# EAGLE design bbbshield (EAGLE 7.5.0)
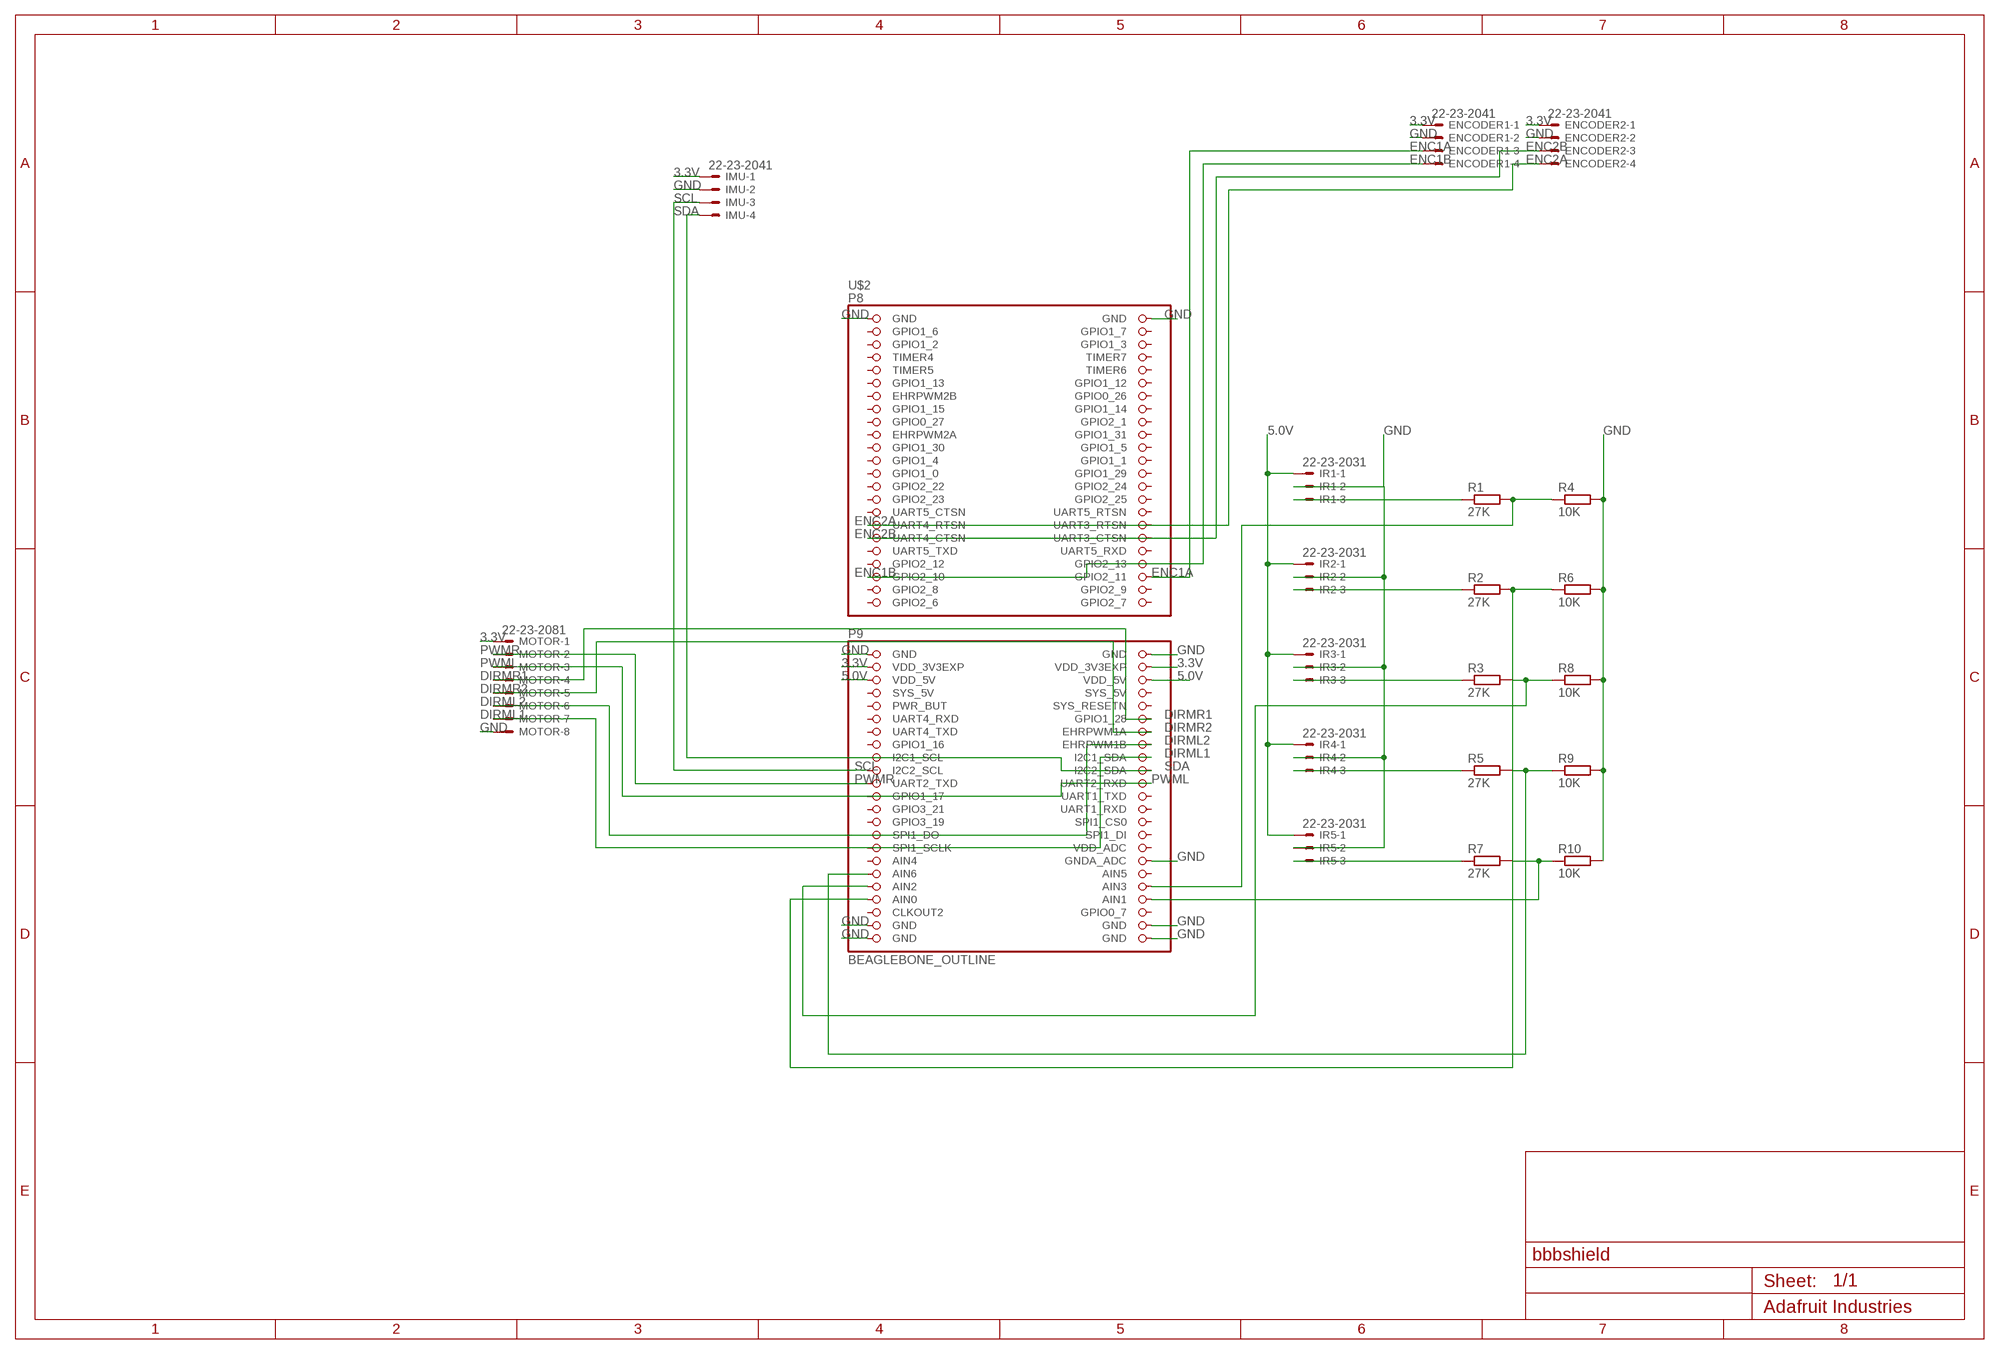
[diagram p0: schematic, sheet 1]

## Parts
ENCODER1  22-23-2041  [22-23-2041]
ENCODER2  22-23-2041  [22-23-2041]
IMU  22-23-2041  [22-23-2041]
IR1  22-23-2031  [22-23-2031]
IR2  22-23-2031  [22-23-2031]
IR3  22-23-2031  [22-23-2031]
IR4  22-23-2031  [22-23-2031]
IR5  22-23-2031  [22-23-2031]
MOTOR  22-23-2081  [22-23-2081]
R1  27K  R-EU_R0603  [R0603]
R2  27K  R-EU_R0603  [R0603]
R3  27K  R-EU_R0603  [R0603]
R4  10K  R-EU_R0603  [R0603]
R5  27K  R-EU_R0603  [R0603]
R6  10K  R-EU_R0603  [R0603]
R7  27K  R-EU_R0603  [R0603]
R8  10K  R-EU_R0603  [R0603]
R9  10K  R-EU_R0603  [R0603]
R10  10K  R-EU_R0603  [R0603]
U$2  BEAGLEBONE_OUTLINE  [BEAGLEBONE_SHIELD]

## Nets
3.3V: ENCODER1.1 ENCODER2.1 IMU.1 MOTOR.1 U$2.49(VDD_3V3EXP) U$2.50(VDD_3V3EXP)
5.0V: IR1.1 IR2.1 IR3.1 IR4.1 IR5.1 U$2.51(VDD_5V) U$2.52(VDD_5V)
DIRML1: MOTOR.7 U$2.64(I2C1_SDA)
DIRML2: MOTOR.6 U$2.62(EHRPWM1B)
DIRMR1: MOTOR.4 U$2.58(GPIO1_28)
DIRMR2: MOTOR.5 U$2.60(EHRPWM1A)
ENC1A: ENCODER1.3 U$2.42(GPIO2_11)
ENC1B: ENCODER1.4 U$2.41(GPIO2_10)
ENC2A: ENCODER2.4 U$2.33(UART4_RTSN)
ENC2B: ENCODER2.3 U$2.35(UART4_CTSN)
GND: ENCODER1.2 ENCODER2.2 IMU.2 IR1.2 IR2.2 IR3.2 IR4.2 IR5.2 MOTOR.8 R4.2 R6.2 R8.2 R9.2 R10.2 U$2.1(GND) U$2.2(GND) U$2.47(GND) U$2.48(GND) U$2.80(GNDA_ADC) U$2.89(GND) U$2.90(GND) U$2.91(GND) U$2.92(GND)
N$12: IR1.3 R1.1
N$18: IR2.3 R2.1
N$19: IR3.3 R3.1
N$21: IR4.3 R5.1
N$22: IR5.3 R7.1
N$23: R2.2 R6.1 U$2.85(AIN0)
N$24: R3.2 R8.1 U$2.83(AIN2)
N$25: R1.2 R4.1 U$2.84(AIN3)
N$26: R5.2 R9.1 U$2.81(AIN6)
N$27: R7.2 R10.1 U$2.86(AIN1)
PWML: MOTOR.3 U$2.68(UART2_RXD)
PWMR: MOTOR.2 U$2.67(UART2_TXD)
SCL: IMU.3 U$2.65(I2C2_SCL)
SDA: IMU.4 U$2.66(I2C2_SDA)
Unconnected: U$2.5(GPIO1_2) U$2.6(GPIO1_3) U$2.7(TIMER4) U$2.8(TIMER7) U$2.9(TIMER5) U$2.10(TIMER6) U$2.11(GPIO1_13) U$2.12(GPIO1_12) U$2.13(EHRPWM2B) U$2.14(GPIO0_26) U$2.15(GPIO1_15) U$2.16(GPIO1_14) U$2.17(GPIO0_27) U$2.18(GPIO2_1) U$2.19(EHRPWM2A) U$2.20(GPIO1_31) U$2.21(GPIO1_30) U$2.22(GPIO1_5) U$2.23(GPIO1_4) U$2.24(GPIO1_1) U$2.25(GPIO1_0) U$2.26(GPIO1_29) U$2.27(GPIO2_22) U$2.28(GPIO2_24) U$2.29(GPIO2_23) U$2.30(GPIO2_25) U$2.31(UART5_CTSN) U$2.32(UART5_RTSN) U$2.34(UART3_RTSN) U$2.36(UART3_CTSN) U$2.37(UART5_TXD) U$2.38(UART5_RXD) U$2.39(GPIO2_12) U$2.40(GPIO2_13) U$2.53(SYS_5V) U$2.54(SYS_5V) U$2.55(PWR_BUT) U$2.56(SYS_RESETN) U$2.57(UART4_RXD) U$2.59(UART4_TXD) U$2.61(GPIO1_16) U$2.63(I2C1_SCL) U$2.69(GPIO1_17) U$2.70(UART1_TXD) U$2.71(GPIO3_21) U$2.72(UART1_RXD) U$2.73(GPIO3_19) U$2.74(SPI1_CS0) U$2.75(SPI1_DO) U$2.76(SPI1_DI) U$2.77(SPI1_SCLK) U$2.78(VDD_ADC) U$2.79(AIN4) U$2.82(AIN5) U$2.87(CLKOUT2) U$2.88(GPIO0_7)

## Power pins joined to a net without a drawn wire
GPIO1_6: U$2.3(GPIO1_6)
GPIO1_7: U$2.4(GPIO1_7)
GPIO2_6: U$2.45(GPIO2_6)
GPIO2_7: U$2.46(GPIO2_7)
GPIO2_8: U$2.43(GPIO2_8)
GPIO2_9: U$2.44(GPIO2_9)

## Library data of the parts
ENCODER1 ENCODER2 IMU = con-molex:22-23-2041: .100" (2.54mm) Center Header - 4 Pin; MF: MOLEX; MPN: 22-23-2041; OC_FARNELL: 1462920; OC_NEWARK: 38C0355
IR1-IR5 = con-molex:22-23-2031: .100" (2.54mm) Center Header - 3 Pin; MF: MOLEX; MPN: 22-23-2031; OC_FARNELL: 1462950; OC_NEWARK: 30C0862
MOTOR = con-molex:22-23-2081: .100" (2.54mm) Center Header - 8 Pin; MF: MOLEX; MPN: 22-23-2081; OC_FARNELL: 1756826; OC_NEWARK: 01C7592
R1-R10 = rcl:R-EU_: RESISTOR, European symbol
U$2 = microbuilder:BEAGLEBONE_OUTLINE

## Module LEVELAHIFTER
Ports: 

### Library data of the parts

## Board
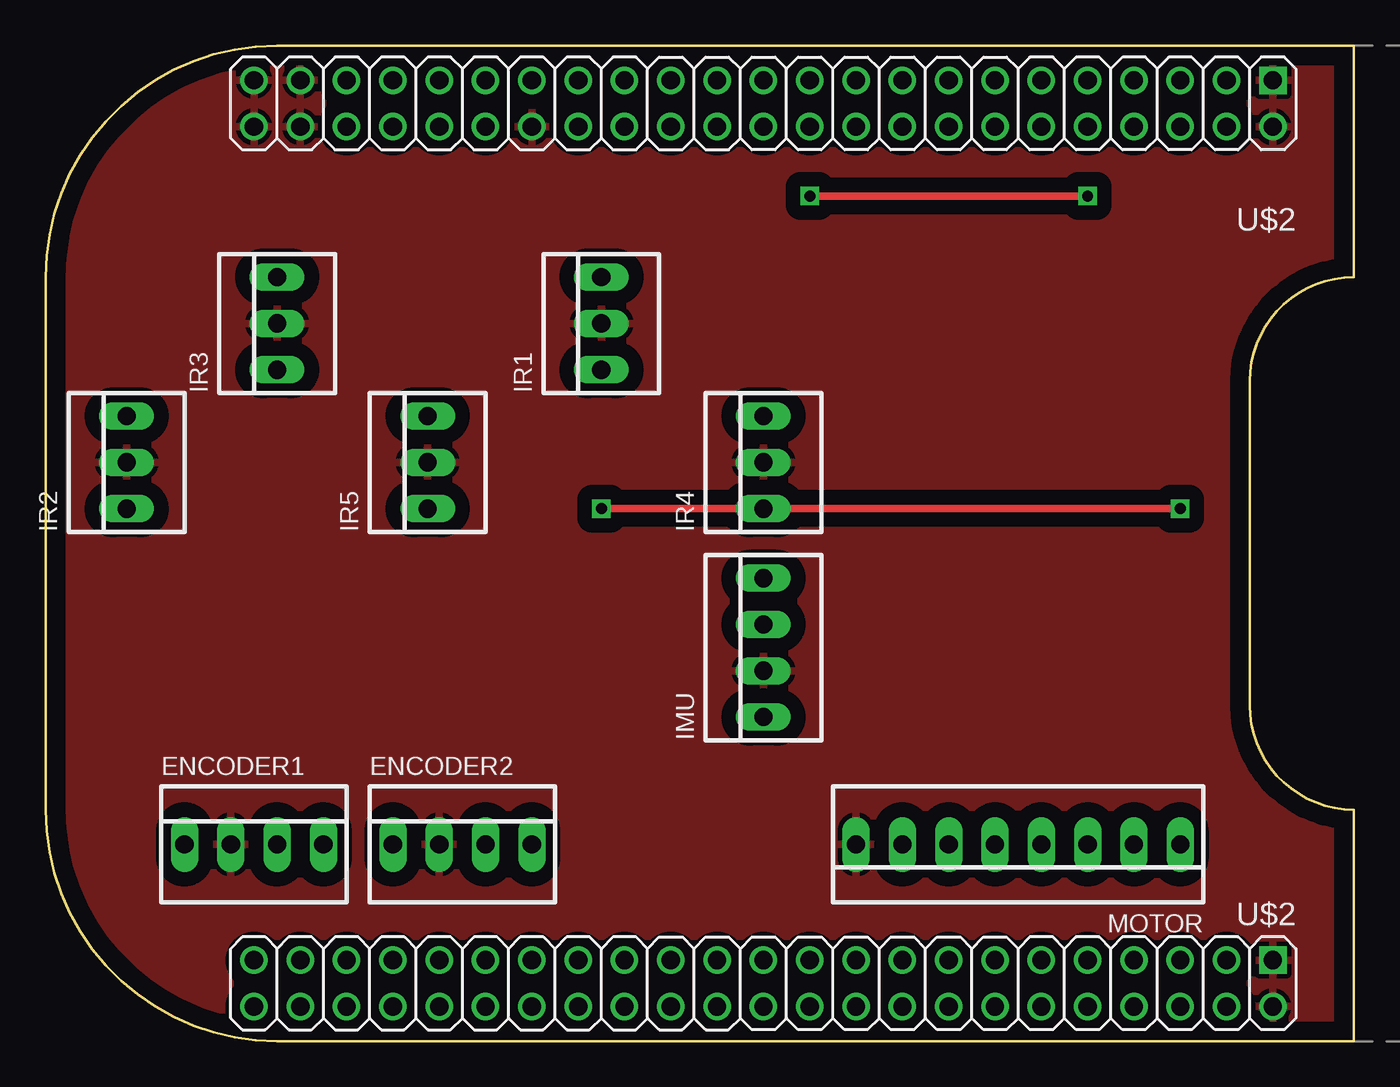
[diagram p1: board, top side]
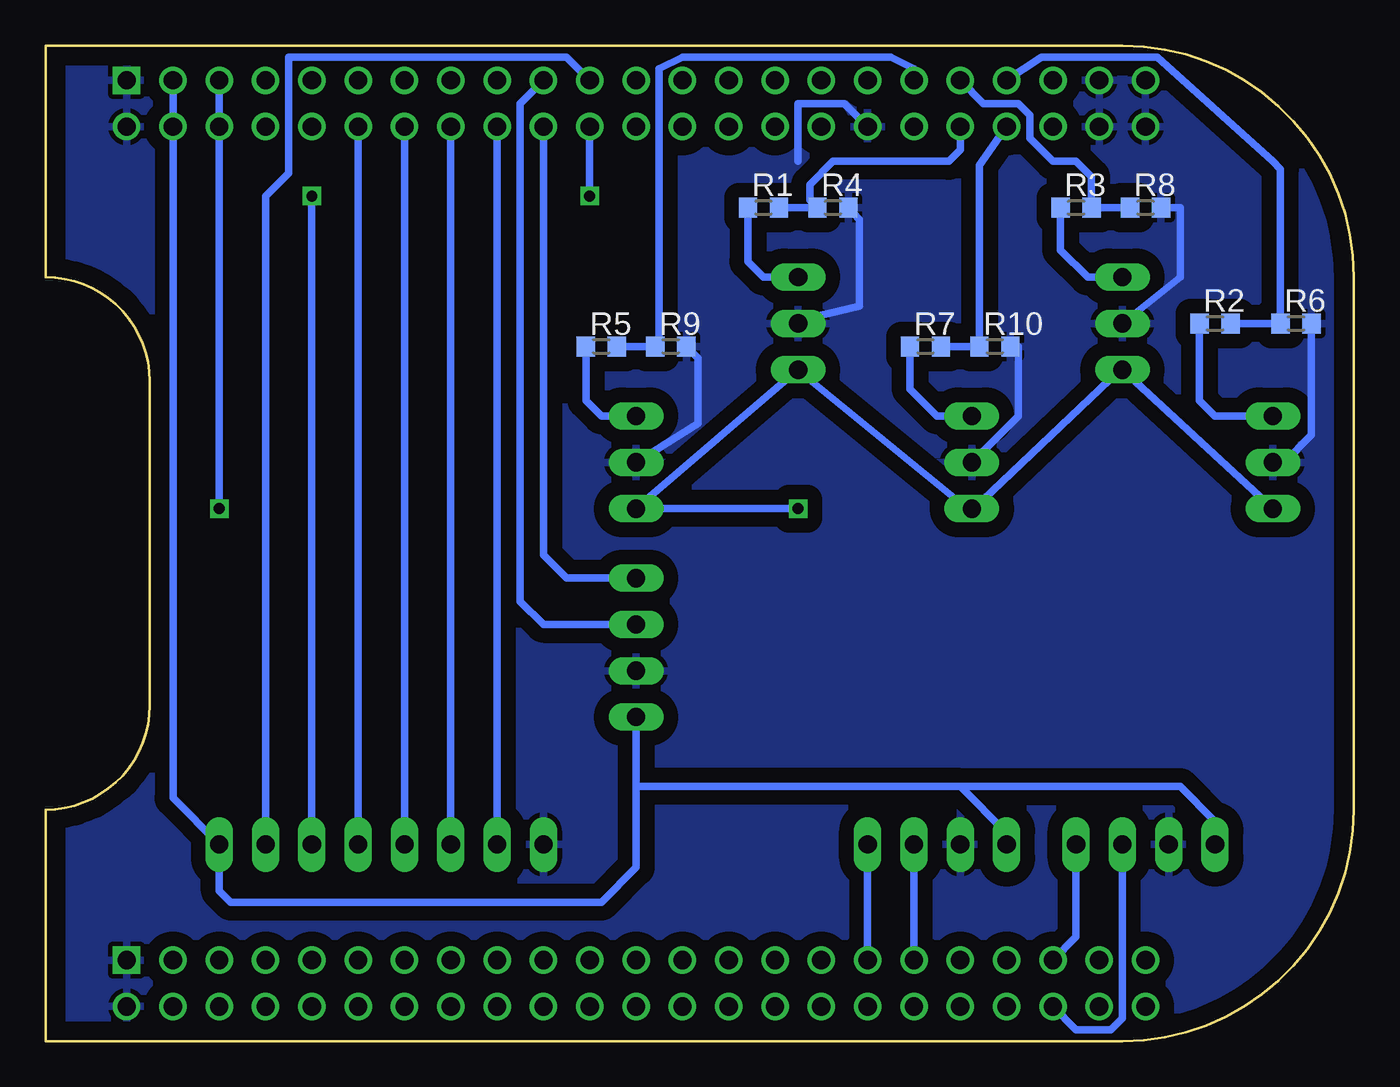
[diagram p2: board, bottom side, seen from below]

Size 71.75 x 54.61 mm. Coordinates in mm from the lower left corner, seen from the top.
Copper layers (1*16): Top 0.035mm / dielectric 1.5mm / Bottom 0.035mm
Design rules "default": minimum track width 10mil, minimum drill 24mil, track to track 8mil, track to pad 8mil, pad to pad 8mil, via to via 8mil, smd to smd 8mil, copper to edge 40mil, drill to drill 8mil, minimum pad ring 10mil, minimum via ring 8mil, stop-mask expansion 4mil, vias tented up to drill 0mil, thermal gap 10mil

### Footprints (pad centres in the part's own frame; a part is rotated, then mirrored left to right if it is on the bottom)
22-23-2041 = drill 1 long: 1 -3.81,0; 2 -1.27,0; 3 1.27,0; 4 3.81,0
22-23-2031 = drill 1 long: 1 -2.54,0; 2 0,0; 3 2.54,0
22-23-2081 = drill 1 long: 1 -8.89,0; 2 -6.35,0; 3 -3.81,0; 4 -1.27,0; 5 1.27,0; 6 3.81,0; 7 6.35,0; 8 8.89,0
R0603 = smd 1 x 1.1: 1 -0.85,0; 2 0.85,0
BEAGLEBONE_SHIELD = drill 1 square: 1 4.445,19.05; 47 52.705,19.05 | drill 1: 2 1.905,19.05; 3 4.445,21.59; 4 1.905,21.59; 5 4.445,24.13; 6 1.905,24.13; 7 4.445,26.67; 8 1.905,26.67; 9 4.445,29.21; 10 1.905,29.21; 11 4.445,31.75; 12 1.905,31.75; 13 4.445,34.29; 14 1.905,34.29; 15 4.445,36.83; 16 1.905,36.83; 17 4.445,39.37; 18 1.905,39.37; 19 4.445,41.91; 20 1.905,41.91; 21 4.445,44.45; 22 1.905,44.45; 23 4.445,46.99; 24 1.905,46.99; 25 4.445,49.53; 26 1.905,49.53; 27 4.445,52.07; 28 1.905,52.07; 29 4.445,54.61; 30 1.905,54.61; 31 4.445,57.15; 32 1.905,57.15; 33 4.445,59.69; 34 1.905,59.69; 35 4.445,62.23; 36 1.905,62.23; 37 4.445,64.77; 38 1.905,64.77; 39 4.445,67.31; 40 1.905,67.31; 41 4.445,69.85; 42 1.905,69.85; 43 4.445,72.39; 44 1.905,72.39; 45 4.445,74.93; 46 1.905,74.93; 48 50.165,19.05; 49 52.705,21.59; 50 50.165,21.59; 51 52.705,24.13; 52 50.165,24.13; 53 52.705,26.67; 54 50.165,26.67; 55 52.705,29.21; 56 50.165,29.21; 57 52.705,31.75; 58 50.165,31.75; 59 52.705,34.29; 60 50.165,34.29; 61 52.705,36.83; 62 50.165,36.83; 63 52.705,39.37; 64 50.165,39.37; 65 52.705,41.91; 66 50.165,41.91; 67 52.705,44.45; 68 50.165,44.45; 69 52.705,46.99; 70 50.165,46.99; 71 52.705,49.53; 72 50.165,49.53; 73 52.705,52.07; 74 50.165,52.07; 75 52.705,54.61; 76 50.165,54.61; 77 52.705,57.15; 78 50.165,57.15; 79 52.705,59.69; 80 50.165,59.69; 81 52.705,62.23; 82 50.165,62.23; 83 52.705,64.77; 84 50.165,64.77; 85 52.705,67.31; 86 50.165,67.31; 87 52.705,69.85; 88 50.165,69.85; 89 52.705,72.39; 90 50.165,72.39; 91 52.705,74.93; 92 50.165,74.93

### Placement (x,y rotation side)
ENCODER1  11.43,10.8 0 top
ENCODER2  22.86,10.8 0 top
IMU  39.37,21.59 90 top
IR1  30.48,39.37 90 top
IR2  4.45,31.75 90 top
IR3  12.7,39.37 90 top
IR4  39.37,31.75 90 top
IR5  20.96,31.75 90 top
MOTOR  53.34,10.8 180 top
R1  32.39,45.72 0 bottom
R2  7.62,39.37 0 bottom
R3  15.24,45.72 0 bottom
R4  28.58,45.72 0 bottom
R5  41.28,38.1 0 bottom
R6  3.18,39.37 0 bottom
R7  23.5,38.1 0 bottom
R8  11.43,45.72 0 bottom
R9  37.47,38.1 0 bottom
R10  19.69,38.1 0 bottom
U$2  86.36,0 90 top

### Tracks (layer width: path | path; a pad name or v marks a point on that pad's centre or on a via)
3.3V
  Bottom 0.406: U$2.49 U$2.50 64.77,13.34 MOTOR.1 62.23,8.25 61.59,7.62 41.28,7.62 39.37,9.52 39.37,13.97 | IMU.1 39.37,13.97 | 21.59,13.97 39.37,13.97 | ENCODER2.1 19.05,11.43 21.59,13.97 | 21.59,13.97 9.53,13.97 7.62,12.07 ENCODER1.1
5.0V  (via drill 0.6)
  Top 0.406: v62.23,29.21 v30.48,29.21
  Bottom 0.406: U$2.51 U$2.52 v62.23,29.21 | 3.18,29.21 IR2.1 IR3.1 12.85,36.78 20.9,29.16 IR5.1 21.13,29.16 30.46,36.78 IR1.1 IR4.1 v30.48,29.21
DIRML1
  Bottom 0.406: U$2.64 MOTOR.7
DIRML2
  Bottom 0.406: U$2.62 MOTOR.6
DIRMR1
  Bottom 0.406: U$2.58 MOTOR.4
DIRMR2
  Bottom 0.406: U$2.60 MOTOR.5
ENC1A
  Bottom 0.406: ENCODER1.3 12.7,1.27 13.34,0.63 15.24,0.63 U$2.42
ENC1B
  Bottom 0.406: ENCODER1.4 15.24,5.72 U$2.41
ENC2A
  Bottom 0.406: ENCODER2.4 U$2.33
ENC2B
  Bottom 0.406: ENCODER2.3 U$2.35
GND
  Bottom 0.406: R4.2 27.13,45.06 27.13,40.31 30.46,39.52 IR1.2 | IR4.2 35.98,33.87 35.98,37.47 R9.2 | R8.2 9.53,45.72 9.53,41.91 IR3.2 | R10.2 18.42,38.1 18.42,34.29 IR5.2 | IR2.2 3.81,31.75 2.33,33.23 R6.2 | U$2.80 27.94,51.44 30.48,51.44 30.48,48.26
  pour Bottom (isolate 0.813): 0,54.61 72.39,54.61 73.66,54.61 73.66,0 0,0 0,16.51
  pour Top (isolate 0.813): 0,54.61 0,0 73.66,0 73.66,54.61
N$12
  Bottom 0.406: R1.1 33.24,42.76 32.39,41.91 IR1.3
N$18
  Bottom 0.406: R2.1 8.47,35.14 7.62,34.29 IR2.3
N$19
  Bottom 0.406: R3.1 16.09,43.4 14.61,41.91 IR3.3
N$21
  Bottom 0.406: R5.1 42.13,35.14 41.28,34.29 IR4.3
N$22
  Bottom 0.406: R7.1 24.35,35.77 22.86,34.29 IR5.3
N$23
  Bottom 0.406: U$2.85 17.15,53.98 10.8,53.98 4.45,48.26 4.03,47.84 R6.1 R2.2
N$24
  Bottom 0.406: R8.1 R3.2 14.39,47.41 15.24,48.26 16.51,48.26 17.78,49.53 17.78,50.8 18.42,51.44 20.32,51.44 U$2.83
N$25
  Bottom 0.406: R1.2 R4.1 29.85,46.14 29.85,46.99 28.58,48.26 22.23,48.26 21.59,48.9 U$2.84
N$26
  Bottom 0.406: U$2.81 24.13,53.34 25.4,53.98 36.83,53.98 38.1,53.34 38.1,38.52 R9.1 R5.2
N$27
  Bottom 0.406: U$2.86 20.54,48.05 R10.1 R7.2
PWML  (via drill 0.6)
  Top 0.406: v57.15,46.36 v41.91,46.36
  Bottom 0.406: v41.91,46.36 U$2.68 | MOTOR.3 v57.15,46.36
PWMR
  Bottom 0.406: U$2.67 43.18,53.98 58.42,53.98 58.42,47.62 59.69,46.36 MOTOR.2
SCL
  Bottom 0.406: U$2.65 45.72,51.44 45.72,24.13 44.45,22.86 IMU.3
SDA
  Bottom 0.406: U$2.66 44.45,26.67 43.18,25.4 IMU.4